# Altium schematic sheet FRAM.SchDoc: FRAM Memory
size A4; DocumentNumber: 15; SheetNumber: 15; SheetTotal: 16; Model: EM1; PageSetup: Record=PageOptions|CenterHorizontal=True|CenterVertical=True|PrintScale=0.52|XCorrection=1.00|YCorrection=1.00|PrintKind=1|BorderSize=5000000|LeftOffset=0|BottomOffset=0|Orientation=2|PaperLength=4200|PaperWidth=2970|Scale=100|PaperSource=7|PrintQuality=600|MediaType=1|DitherType=10|PaperKind=A3|PrintScaleMode=1
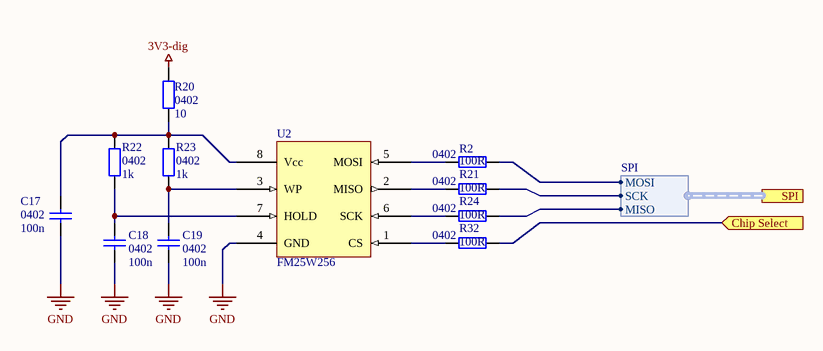
[diagram p0: FRAM.SchDoc]

## Parts
C17  0402  value 100n  [SMD_Capacitor_0402]
C18  0402  value 100n  [SMD_Capacitor_0402]
C19  0402  value 100n  [SMD_Capacitor_0402]
R2  0402  value 100R  [SMD_Resistor_0402]
R20  0402  value 10  [SMD_Resistor_0402]
R21  0402  value 100R  [SMD_Resistor_0402]
R22  0402  value 1k  [SMD_Resistor_0402]
R23  0402  value 1k  [SMD_Resistor_0402]
R24  0402  value 100R  [SMD_Resistor_0402]
R32  0402  value 100R  [SMD_Resistor_0402]
U2  FM25W256  [SOIC-8-N]

## Ports
Chip Select (in), SPI (harness SPI)

## Harnesses
SPI: MOSI, MISO, SCK

## Nets
3V3-dig: R20.2
GND: C17.2 C18.2 C19.2 U2.4(GND)
Chip Select: R32.1 ; port Chip Select
NetC17_1: C17.1 R20.1 R22.2 R23.2 U2.8(Vcc)
NetC18_1: C18.1 R22.1 U2.7(HOLD)
NetC19_1: C19.1 R23.1 U2.3(WP)
NetR2_1: R2.1 ; port SPI.MOSI
NetR2_2: R2.2 U2.5(MOSI)
NetR21_1: R21.1 ; port SPI.SCK
NetR21_2: R21.2 U2.2(MISO)
NetR24_1: R24.1 ; port SPI.MISO
NetR24_2: R24.2 U2.6(SCK)
NetR32_2: R32.2 U2.1(CS)

## Notes on the sheet
- Title:
- Sheet:
- of
- Author:
- Model:
- Document Number:
- Checked by:
- Iss-Rev:
- Approved by:
- Date:
- File name:

## Library data of the parts
C17-C19 = Cap1: Capacitor; Published: 8-Jun-2000; LatestRevisionDate: 17-Jul-2002; LatestRevisionNote: Re-released for DXP Platform.; PackageReference: RAD-0.3; Publisher: Altium Limited; PackageDescription: Radial Cap, Thru-Hole; 2 Leads; 0.3 in Pin Spacing
R2 R20-R24 R32 = Res2: Resistor; Published: 8-Jun-2000; LatestRevisionDate: 17-Jul-2002; LatestRevisionNote: Re-released for DXP Platform.; PackageReference: AXIAL-0.4; Publisher: Altium Limited; PackageDescription: Axial Device, Thru-Hole; 2 Leads; 0.4 in Pin Spacing
U2 = FM25W256: 256Kb (8k x 32) SPI F-RAM